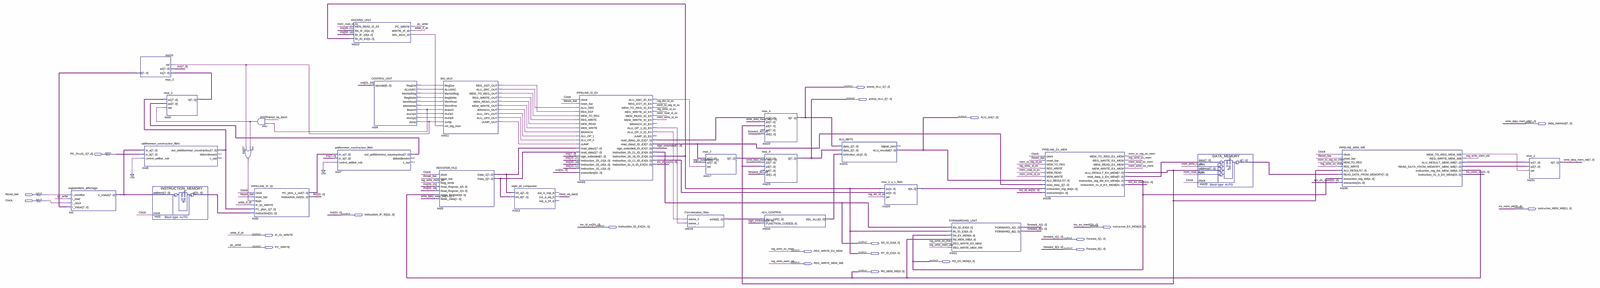
[diagram p0: schematic sheet, whole]
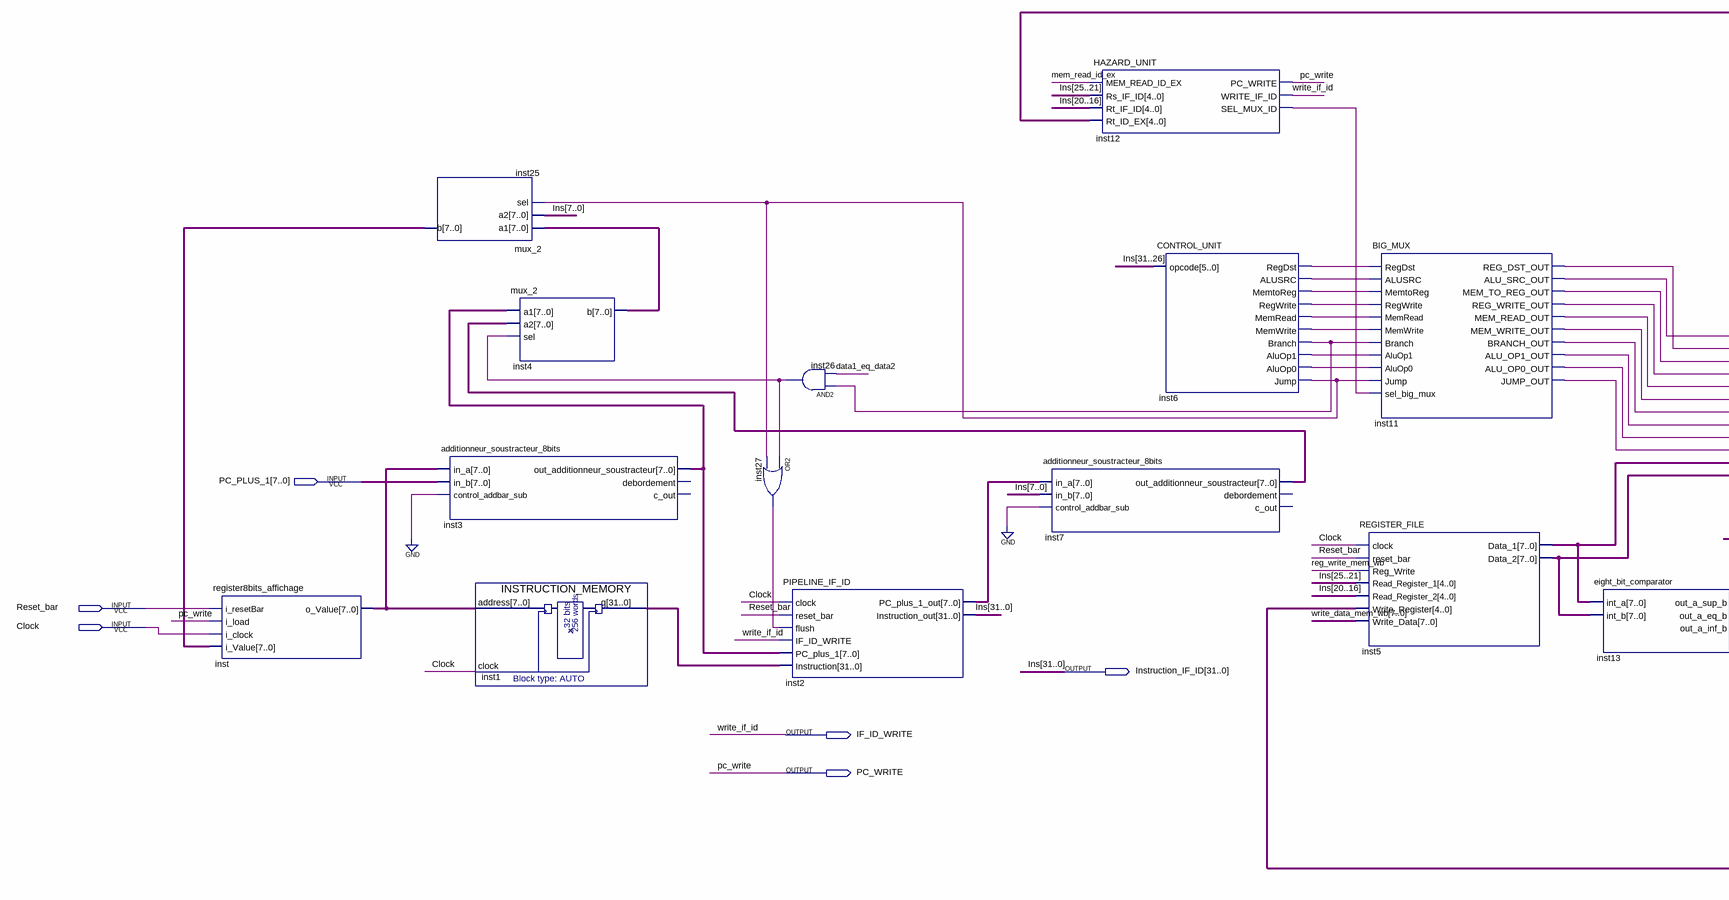
[diagram p1: schematic sheet, left part]
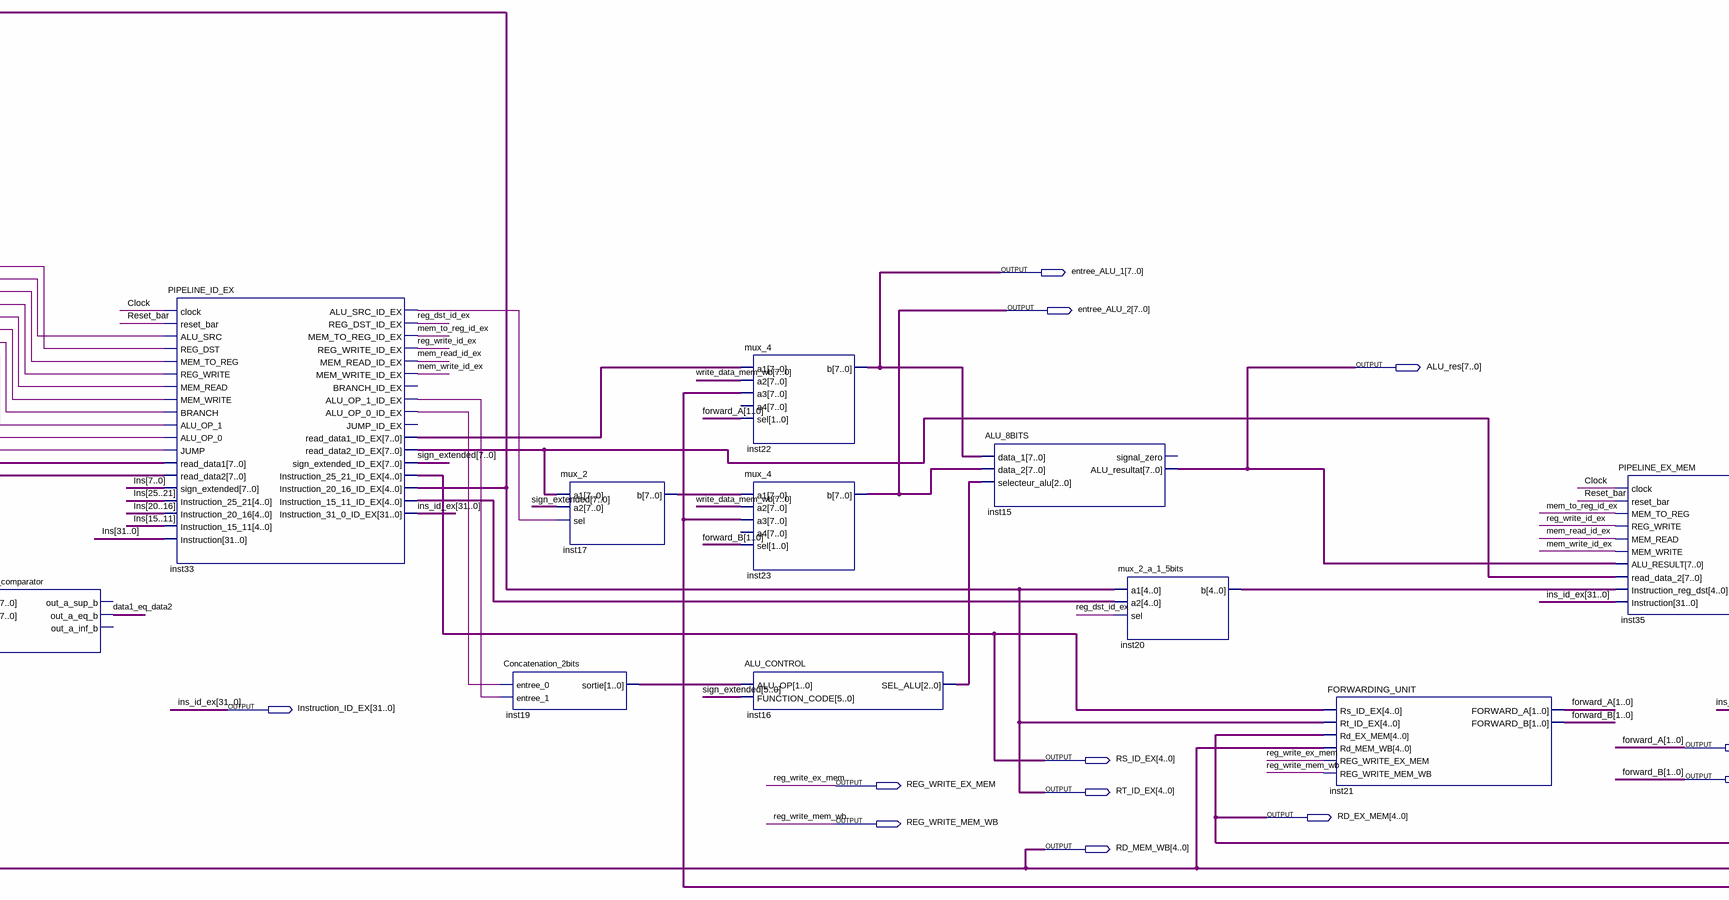
[diagram p2: schematic sheet, centre part]
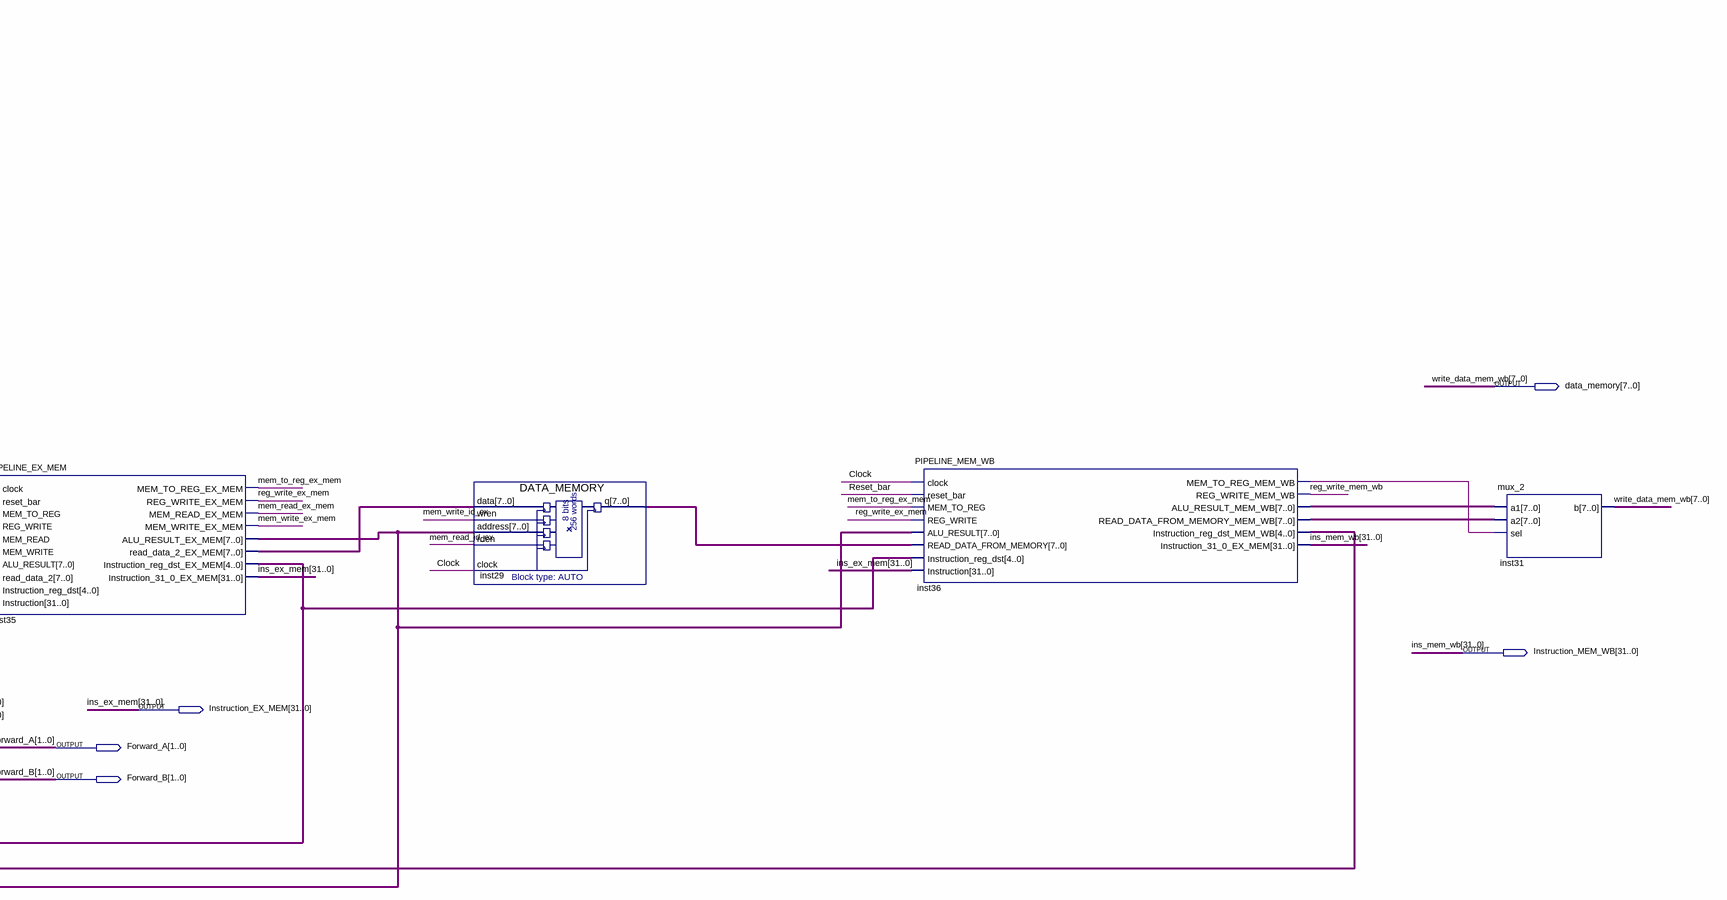
[diagram p3: schematic sheet, right part]
// Quartus schematic Processor_MIPS_with_Pipelines_diagram.bdf as structural Verilog: 27 symbols, 21 pins
module Processor_MIPS_with_Pipelines_diagram (
  input  [7:0] PC_PLUS_1,
  input  Reset_bar,
  input  Clock,
  output [7:0] entree_ALU_1,
  output [7:0] entree_ALU_2,
  output [7:0] ALU_res,
  output [7:0] data_memory,
  output [31:0] Instruction_MEM_WB,
  output [31:0] Instruction_IF_ID,
  output [31:0] Instruction_ID_EX,
  output [31:0] Instruction_EX_MEM,
  output IF_ID_WRITE,
  output [1:0] Forward_A,
  output [4:0] RS_ID_EX,
  output PC_WRITE,
  output [1:0] Forward_B,
  output REG_WRITE_EX_MEM,
  output [4:0] RT_ID_EX,
  output [4:0] RD_EX_MEM,
  output REG_WRITE_MEM_WB,
  output [4:0] RD_MEM_WB
);

  wire data1_eq_data2, inst6_aluop0, inst6_aluop1, inst6_alusrc, inst6_branch, inst6_jump, inst6_memread,
       inst6_memtoreg, inst6_memwrite, inst6_regdst, inst6_regwrite, inst11_alu_op0_out, inst11_alu_op1_out,
       inst11_alu_src_out, inst11_branch_out, inst11_jump_out, inst11_mem_read_out, inst11_mem_to_reg_out,
       inst11_mem_write_out, inst11_reg_dst_out, inst11_reg_write_out, inst12_sel_mux_id, inst26_out,
       inst27_out, inst33_alu_op_0_id_ex, inst33_alu_op_1_id_ex, inst33_alu_src_id_ex,
       inst36_mem_to_reg_mem_wb, mem_read_ex_mem, mem_read_id_ex, mem_to_reg_ex_mem, mem_to_reg_id_ex,
       mem_write_ex_mem, mem_write_id_ex, reg_dst_id_ex, reg_write_id_ex;
  wire [1:0] inst19_sortie;
  wire [2:0] inst16_sel_alu;
  wire [4:0] inst20_b, inst33_instruction_15_11_id_ex;
  wire [7:0] inst2_pc_plus_1_out, inst3_out_additionneur_soustracteur, inst4_b, inst5_data_1, inst5_data_2,
       inst7_out_additionneur_soustracteur, inst17_b, inst25_b, inst29_q, inst33_read_data1_id_ex,
       inst33_read_data2_id_ex, inst35_alu_result_ex_mem, inst35_read_data_2_ex_mem,
       inst36_alu_result_mem_wb, inst36_read_data_from_memory_mem_wb, inst_o_value, sign_extended;
  wire [31:0] inst1_q;

  register8bits_affichage inst (
    .i_resetBar(Reset_bar), .i_load(PC_WRITE), .i_clock(Clock), .i_Value(inst25_b), .o_Value(inst_o_value));
  mux_2 inst25 (.a1(inst4_b), .a2(Instruction_IF_ID[7:0]), .sel(inst6_jump), .b(inst25_b));
  additionneur_soustracteur_8bits inst3 (
    .in_a(inst_o_value), .in_b(PC_PLUS_1), .control_addbar_sub(1'b0),
    .out_additionneur_soustracteur(inst3_out_additionneur_soustracteur));  // open: debordement, c_out
  INSTRUCTION_MEMORY inst1 (.address(inst_o_value), .clock(Clock), .q(inst1_q));
  mux_2 inst4 (
    .a1(inst3_out_additionneur_soustracteur), .a2(inst7_out_additionneur_soustracteur), .sel(inst26_out),
    .b(inst4_b));
  or inst27 (inst27_out, inst26_out, inst6_jump);
  and inst26 (inst26_out, inst6_branch, data1_eq_data2);
  PIPELINE_IF_ID inst2 (
    .clock(Clock), .reset_bar(Reset_bar), .flush(inst27_out), .IF_ID_WRITE(IF_ID_WRITE),
    .PC_plus_1(inst3_out_additionneur_soustracteur), .Instruction(inst1_q),
    .PC_plus_1_out(inst2_pc_plus_1_out), .Instruction_out(Instruction_IF_ID));
  additionneur_soustracteur_8bits inst7 (
    .in_a(inst2_pc_plus_1_out), .in_b(Instruction_IF_ID[7:0]), .control_addbar_sub(1'b0),
    .out_additionneur_soustracteur(inst7_out_additionneur_soustracteur));  // open: debordement, c_out
  HAZARD_UNIT inst12 (
    .MEM_READ_ID_EX(mem_read_id_ex), .Rs_IF_ID(Instruction_IF_ID[25:21]),
    .Rt_IF_ID(Instruction_IF_ID[20:16]), .Rt_ID_EX(RT_ID_EX), .PC_WRITE(PC_WRITE), .WRITE_IF_ID(IF_ID_WRITE),
    .SEL_MUX_ID(inst12_sel_mux_id));
  CONTROL_UNIT inst6 (
    .opcode(Instruction_IF_ID[31:26]), .RegDst(inst6_regdst), .ALUSRC(inst6_alusrc),
    .MemtoReg(inst6_memtoreg), .RegWrite(inst6_regwrite), .MemRead(inst6_memread), .MemWrite(inst6_memwrite),
    .Branch(inst6_branch), .AluOp1(inst6_aluop1), .AluOp0(inst6_aluop0), .Jump(inst6_jump));
  REGISTER_FILE inst5 (
    .clock(Clock), .reset_bar(Reset_bar), .Reg_Write(REG_WRITE_MEM_WB),
    .Read_Register_1(Instruction_IF_ID[25:21]), .Read_Register_2(Instruction_IF_ID[20:16]),
    .Write_Register(RD_MEM_WB), .Write_Data(data_memory), .Data_1(inst5_data_1), .Data_2(inst5_data_2));
  BIG_MUX inst11 (
    .RegDst(inst6_regdst), .ALUSRC(inst6_alusrc), .MemtoReg(inst6_memtoreg), .RegWrite(inst6_regwrite),
    .MemRead(inst6_memread), .MemWrite(inst6_memwrite), .Branch(inst6_branch), .AluOp1(inst6_aluop1),
    .AluOp0(inst6_aluop0), .Jump(inst6_jump), .sel_big_mux(inst12_sel_mux_id),
    .REG_DST_OUT(inst11_reg_dst_out), .ALU_SRC_OUT(inst11_alu_src_out),
    .MEM_TO_REG_OUT(inst11_mem_to_reg_out), .REG_WRITE_OUT(inst11_reg_write_out),
    .MEM_READ_OUT(inst11_mem_read_out), .MEM_WRITE_OUT(inst11_mem_write_out), .BRANCH_OUT(inst11_branch_out),
    .ALU_OP1_OUT(inst11_alu_op1_out), .ALU_OP0_OUT(inst11_alu_op0_out), .JUMP_OUT(inst11_jump_out));
  eight_bit_comparator inst13 (
    .int_a(inst5_data_1), .int_b(inst5_data_2), .out_a_eq_b(data1_eq_data2));  // open: out_a_sup_b, out_a_inf_b
  PIPELINE_ID_EX inst33 (
    .clock(Clock), .reset_bar(Reset_bar), .ALU_SRC(inst11_alu_src_out), .REG_DST(inst11_reg_dst_out),
    .MEM_TO_REG(inst11_mem_to_reg_out), .REG_WRITE(inst11_reg_write_out), .MEM_READ(inst11_mem_read_out),
    .MEM_WRITE(inst11_mem_write_out), .BRANCH(inst11_branch_out), .ALU_OP_1(inst11_alu_op1_out),
    .ALU_OP_0(inst11_alu_op0_out), .JUMP(inst11_jump_out), .read_data1(inst5_data_1),
    .read_data2(inst5_data_2), .sign_extended(Instruction_IF_ID[7:0]),
    .Instruction_25_21(Instruction_IF_ID[25:21]), .Instruction_20_16(Instruction_IF_ID[20:16]),
    .Instruction_15_11(Instruction_IF_ID[15:11]), .Instruction(Instruction_IF_ID),
    .ALU_SRC_ID_EX(inst33_alu_src_id_ex), .REG_DST_ID_EX(reg_dst_id_ex), .MEM_TO_REG_ID_EX(mem_to_reg_id_ex),
    .REG_WRITE_ID_EX(reg_write_id_ex), .MEM_READ_ID_EX(mem_read_id_ex), .MEM_WRITE_ID_EX(mem_write_id_ex),
    .ALU_OP_1_ID_EX(inst33_alu_op_1_id_ex), .ALU_OP_0_ID_EX(inst33_alu_op_0_id_ex),
    .read_data1_ID_EX(inst33_read_data1_id_ex), .read_data2_ID_EX(inst33_read_data2_id_ex),
    .sign_extended_ID_EX(sign_extended), .Instruction_25_21_ID_EX(RS_ID_EX),
    .Instruction_20_16_ID_EX(RT_ID_EX), .Instruction_15_11_ID_EX(inst33_instruction_15_11_id_ex),
    .Instruction_31_0_ID_EX(Instruction_ID_EX));  // open: BRANCH_ID_EX, JUMP_ID_EX
  Concatenation_2bits inst19 (
    .entree_0(inst33_alu_op_0_id_ex), .entree_1(inst33_alu_op_1_id_ex), .sortie(inst19_sortie));
  mux_2 inst17 (.a1(inst33_read_data2_id_ex), .a2(sign_extended), .sel(inst33_alu_src_id_ex), .b(inst17_b));
  mux_4 inst22 (
    .a1(inst33_read_data1_id_ex), .a2(data_memory), .a3(inst35_alu_result_ex_mem), .sel(Forward_A),
    .b(entree_ALU_1));  // open: a4
  mux_4 inst23 (
    .a1(inst17_b), .a2(data_memory), .a3(inst35_alu_result_ex_mem), .sel(Forward_B), .b(entree_ALU_2));  // open: a4
  ALU_CONTROL inst16 (.ALU_OP(inst19_sortie), .FUNCTION_CODE(sign_extended[5:0]), .SEL_ALU(inst16_sel_alu));
  ALU_8BITS inst15 (
    .data_1(entree_ALU_1), .data_2(entree_ALU_2), .selecteur_alu(inst16_sel_alu), .ALU_resultat(ALU_res));  // open: signal_zero
  mux_2_a_1_5bits inst20 (.a1(RT_ID_EX), .a2(inst33_instruction_15_11_id_ex), .sel(reg_dst_id_ex), .b(inst20_b));
  FORWARDING_UNIT inst21 (
    .Rs_ID_EX(RS_ID_EX), .Rt_ID_EX(RT_ID_EX), .Rd_EX_MEM(RD_EX_MEM), .Rd_MEM_WB(RD_MEM_WB),
    .REG_WRITE_EX_MEM(REG_WRITE_EX_MEM), .REG_WRITE_MEM_WB(REG_WRITE_MEM_WB), .FORWARD_A(Forward_A),
    .FORWARD_B(Forward_B));
  PIPELINE_EX_MEM inst35 (
    .clock(Clock), .reset_bar(Reset_bar), .MEM_TO_REG(mem_to_reg_id_ex), .REG_WRITE(reg_write_id_ex),
    .MEM_READ(mem_read_id_ex), .MEM_WRITE(mem_write_id_ex), .ALU_RESULT(ALU_res),
    .read_data_2(inst33_read_data2_id_ex), .Instruction_reg_dst(inst20_b), .Instruction(Instruction_ID_EX),
    .MEM_TO_REG_EX_MEM(mem_to_reg_ex_mem), .REG_WRITE_EX_MEM(REG_WRITE_EX_MEM),
    .MEM_READ_EX_MEM(mem_read_ex_mem), .MEM_WRITE_EX_MEM(mem_write_ex_mem),
    .ALU_RESULT_EX_MEM(inst35_alu_result_ex_mem), .read_data_2_EX_MEM(inst35_read_data_2_ex_mem),
    .Instruction_reg_dst_EX_MEM(RD_EX_MEM), .Instruction_31_0_EX_MEM(Instruction_EX_MEM));
  DATA_MEMORY inst29 (
    .data(inst35_read_data_2_ex_mem), .wren(mem_write_id_ex), .address(inst35_alu_result_ex_mem),
    .rden(mem_read_id_ex), .clock(Clock), .q(inst29_q));
  PIPELINE_MEM_WB inst36 (
    .clock(Clock), .reset_bar(Reset_bar), .MEM_TO_REG(mem_to_reg_ex_mem), .REG_WRITE(REG_WRITE_EX_MEM),
    .ALU_RESULT(inst35_alu_result_ex_mem), .READ_DATA_FROM_MEMORY(inst29_q), .Instruction_reg_dst(RD_EX_MEM),
    .Instruction(Instruction_EX_MEM), .MEM_TO_REG_MEM_WB(inst36_mem_to_reg_mem_wb),
    .REG_WRITE_MEM_WB(REG_WRITE_MEM_WB), .ALU_RESULT_MEM_WB(inst36_alu_result_mem_wb),
    .READ_DATA_FROM_MEMORY_MEM_WB(inst36_read_data_from_memory_mem_wb),
    .Instruction_reg_dst_MEM_WB(RD_MEM_WB), .Instruction_31_0_EX_MEM(Instruction_MEM_WB));
  mux_2 inst31 (
    .a1(inst36_alu_result_mem_wb), .a2(inst36_read_data_from_memory_mem_wb), .sel(inst36_mem_to_reg_mem_wb),
    .b(data_memory));

  // Other names for the same wires on the sheet: Ins[31:0] = Instruction_IF_ID; ins_ex_mem[31:0] = Instruction_EX_MEM;
  //   ins_id_ex[31:0] = Instruction_ID_EX; ins_mem_wb[31:0] = Instruction_MEM_WB;
  //   write_data_mem_wb[7:0] = data_memory; write_if_id = IF_ID_WRITE
endmodule
